# Altium schematic sheet Interface.SchDoc
size A4; SheetNumber: 7; SheetTotal: 8; ENG_APP_DATE: --/--/--; DSN_APP_DATE: --/--/--; CHK_APP_DATE: --/--/--
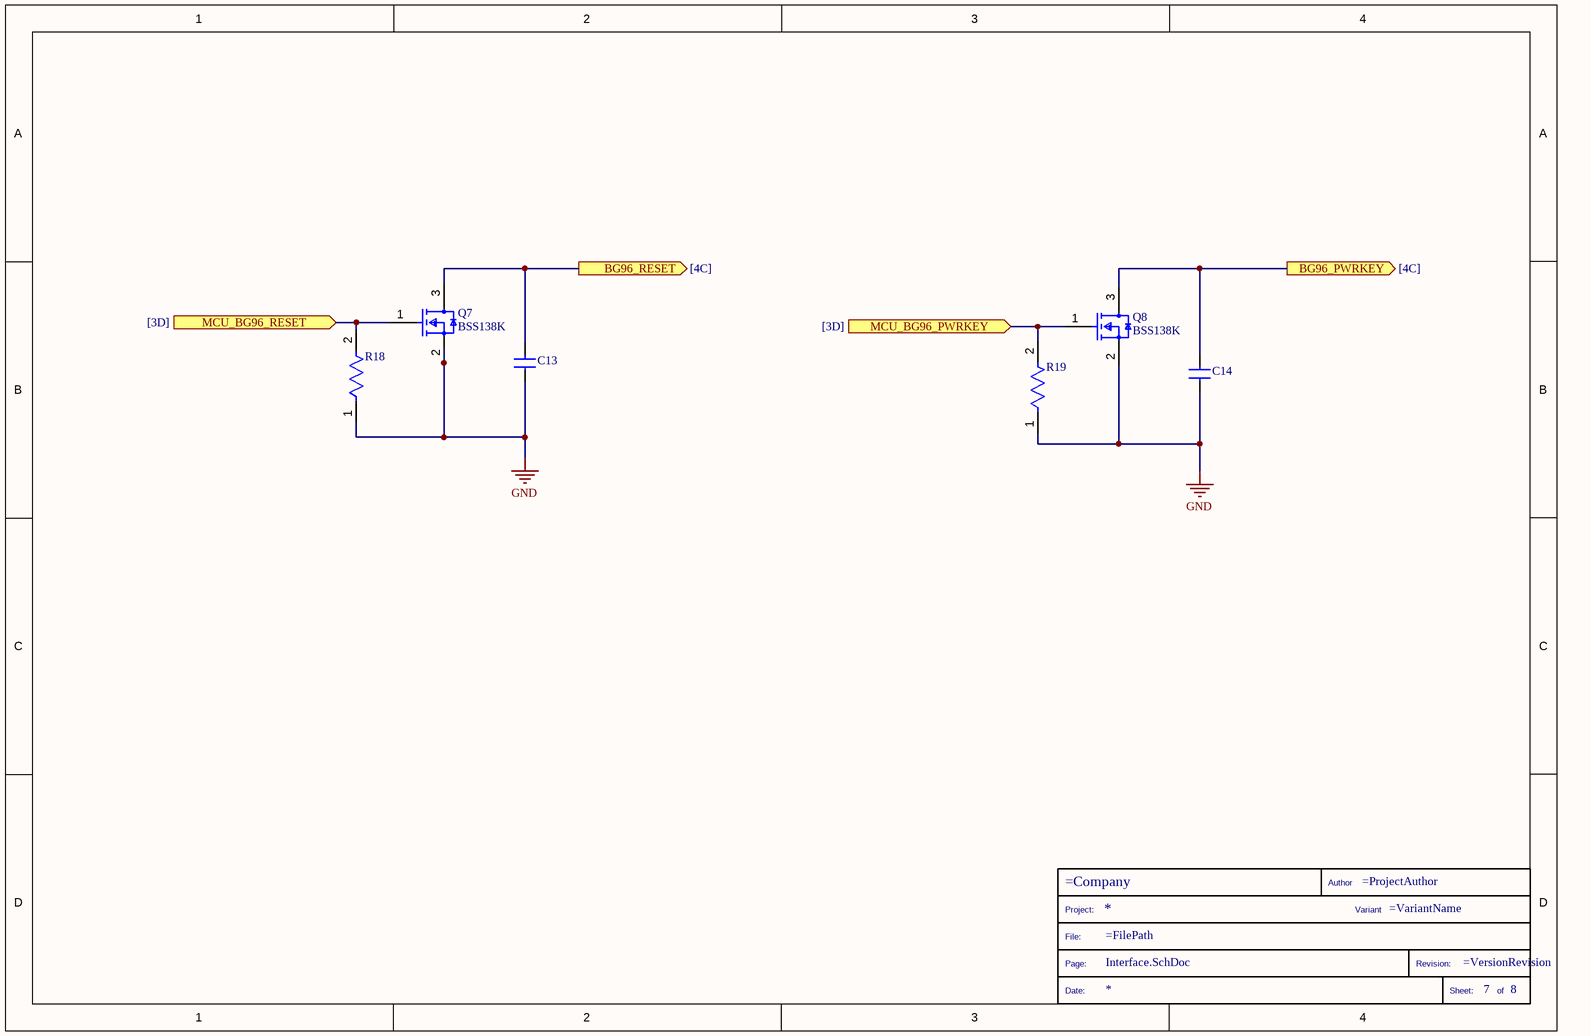
[diagram p0: Interface.SchDoc]

## Parts
*?  TitleBlock  (value not drawn)  (graphical)
C13  CL05B104KB54PNC  [CAPC1005X06N]  (value not drawn)
C14  CL05B104KB54PNC  [CAPC1005X06N]  (value not drawn)
Q7  BSS138K  [FP-318-08-IPC_B]
Q8  BSS138K  [FP-318-08-IPC_B]
R18  0402WGF1002TCE  [FP-CRCW0402-e3-MFG]  (value not drawn)
R19  0402WGF1002TCE  [FP-CRCW0402-e3-MFG]  (value not drawn)

## Ports
BG96_PWRKEY (out, see [4C]), BG96_RESET (out, see [4C]), MCU_BG96_PWRKEY (in, see [3D]), MCU_BG96_RESET (in, see [3D])

## Nets
GND: C13.1 C14.1 Q7.2(S) Q8.2(S) R18.1 R19.1
BG96_PWRKEY: C14.2 Q8.3(D) ; port BG96_PWRKEY
BG96_RESET: C13.2 Q7.3(D) ; port BG96_RESET
MCU_BG96_PWRKEY: Q8.1(G) R19.2 ; port MCU_BG96_PWRKEY
MCU_BG96_RESET: Q7.1(G) R18.2 ; port MCU_BG96_RESET

## Notes on the sheet
- DWG. NO.
- REV.
- SHT.
- THIS DOCUMENT AND THE DATA DISCLOSED HEREIN OR HEREWITH IS THE PROPERTY OF ALTIUM LIMITED AND MAY BE FREELY DISTRIBUTED IN WHOLE. NO RIGHTS ARE RESERVED OR EXPRESS OR IMPLIED WARANTEE GIVEN.
- REVISION
- DESCRIPTION
- DATE
- APPROVED
- ENG:
- APPROVALS
- PROJECT
- DSN:
- CHK:
- REFERENCE DOCUMENTS
- PROJECT REVISION:
- TITLE
- DOCUMENT REVISION:
- DESIGN ITEM:
- BOM:
- FAB DWG:
- PCB DWG:
- ASSY DWG:
- SCALE:
- SIZE
- B
- CAGE CODE
- FILE NAME
- DWG NO.
- SHEET
- OF
- REV
- (in symbol TitleBlock) Author; Project:; Variant; File:; Page:; Revision:; Date:; Sheet:; of

## Library data of the parts
C13 C14 = LPN0009: 100nF 50V X7R ±10% 0402 MLCC; Manufacturer 1: TDK; Manufacturer Part Number 1: C1005C0G1H060C; Supplier 1: Digi-Key; Supplier Part Number 1: 1276-CL05B104KB54PNCCT-ND; Lumen Part Number: LPN0009
Q7 Q8 = LPN0007: MOSFET N-CH 50V 220MA SOT-23; Manufacturer 1: ON Semiconductor / Fairchild; Manufacturer Part Number 1: BSS138; Supplier 1: Digi-Key; Supplier Part Number 1: BSS138K-13DICT-ND; Lumen Part Number: LPN0007
R18 R19 = LPN0003: Res Thick Film 0402 10K Ohm 1% 0.063W; Manufacturer 1: Vishay Dale; Manufacturer Part Number 1: CRCW04021K00FKED; Supplier 1: Mouser; Supplier Part Number 1: 303-0402WGF1002TCE; Lumen Part Number: LPN0003